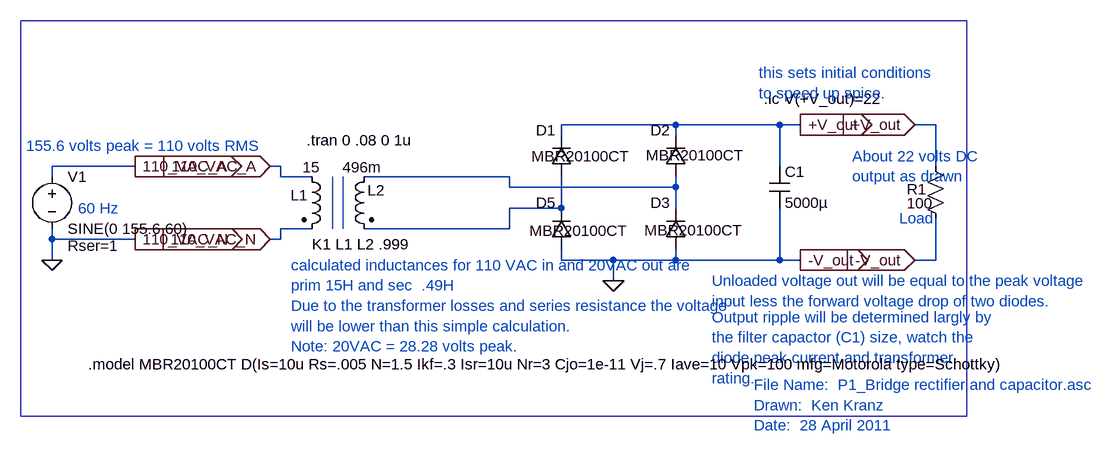
[diagram p0: schematic P1_Bridge_rectifier_and_capacitor.asc]
P1_Bridge_rectifier_and_capacitor.asc, the LTspice schematic file:
Version 4
SHEET 1 1320 680
WIRE 656 0 480 0
WIRE 816 0 656 0
WIRE 848 0 816 0
WIRE 1056 0 1024 0
WIRE 480 16 480 0
WIRE 656 16 656 0
WIRE -176 64 -304 64
WIRE 48 64 32 64
WIRE 816 64 816 0
WIRE 1056 64 1056 0
WIRE -304 80 -304 64
WIRE 48 80 48 64
WIRE 96 80 48 80
WIRE 400 80 176 80
WIRE 400 96 400 80
WIRE 656 96 656 80
WIRE 656 96 400 96
WIRE 480 128 480 80
WIRE 480 128 400 128
WIRE 656 128 656 96
WIRE 96 160 48 160
WIRE 400 160 400 128
WIRE 400 160 176 160
WIRE -304 176 -304 160
WIRE -176 176 -304 176
WIRE 48 176 48 160
WIRE 48 176 32 176
WIRE -304 208 -304 176
WIRE 480 208 480 192
WIRE 560 208 480 208
WIRE 656 208 656 192
WIRE 656 208 560 208
WIRE 816 208 816 128
WIRE 816 208 656 208
WIRE 848 208 816 208
WIRE 1056 208 1056 144
WIRE 1056 208 1024 208
WIRE 560 240 560 208
FLAG 32 64 110_VAC_A
IOPIN 32 64 In
FLAG 32 176 110_VAC_N
IOPIN 32 176 In
FLAG -304 208 0
FLAG -176 64 110_VAC_A
IOPIN -176 64 Out
FLAG -176 176 110_VAC_N
IOPIN -176 176 Out
FLAG 1024 0 +V_out
IOPIN 1024 0 In
FLAG 848 0 +V_out
IOPIN 848 0 Out
FLAG 848 208 -V_out
IOPIN 848 208 Out
FLAG 1024 208 -V_out
IOPIN 1024 208 In
FLAG 560 240 0
SYMBOL ind2 80 64 R0
WINDOW 0 -17 44 Left 0
WINDOW 3 2 1 Left 0
SYMATTR InstName L1
SYMATTR Value 15
SYMATTR Type ind
SYMATTR SpiceLine Rser=1
SYMBOL ind2 192 64 M0
WINDOW 0 -17 37 Left 0
WINDOW 3 -12 1 Left 0
SYMATTR InstName L2
SYMATTR Value 496m
SYMATTR Type ind
SYMATTR SpiceLine Rser=5m
SYMBOL cap 800 64 R0
SYMATTR InstName C1
SYMATTR Value 5000µ
SYMBOL voltage -304 64 R0
WINDOW 123 0 0 Left 0
WINDOW 39 24 122 Left 0
SYMATTR SpiceLine Rser=1
SYMATTR InstName V1
SYMATTR Value SINE(0 155.6 60)
SYMBOL res 1040 48 R0
WINDOW 0 -28 51 Left 0
WINDOW 3 -28 73 Left 0
SYMATTR InstName R1
SYMATTR Value 100
SYMBOL diode 496 192 R180
WINDOW 0 24 72 Left 0
WINDOW 3 -88 29 Left 0
SYMATTR InstName D5
SYMATTR Value MBR20100CT
SYMBOL diode 496 80 R180
WINDOW 0 24 72 Left 0
WINDOW 3 -91 32 Left 0
SYMATTR InstName D1
SYMATTR Value MBR20100CT
SYMBOL diode 672 80 R180
WINDOW 0 24 72 Left 0
WINDOW 3 -91 33 Left 0
SYMATTR InstName D2
SYMATTR Value MBR20100CT
SYMBOL diode 672 192 R180
WINDOW 0 24 72 Left 0
WINDOW 3 -89 30 Left 0
SYMATTR InstName D3
SYMATTR Value MBR20100CT
TEXT 88 24 Left 0 !.tran 0 .08 0 1u
TEXT 96 184 Left 0 !K1 L1 L2 .999
TEXT -344 32 Left 0 ;155.6 volts peak = 110 volts RMS
TEXT -264 128 Left 0 ;60 Hz
TEXT 1000 144 Left 0 ;Load
TEXT 712 240 Left 0 ;Unloaded voltage out will be equal to the peak voltage\ninput less the forward voltage drop of two diodes.
TEXT 792 -40 Left 0 !.ic V(+V_out)=22
TEXT 776 400 Left 0 ;File Name:  P1_Bridge rectifier and capacitor.asc\nDrawn:  Ken Kranz\nDate:  28 April 2011
TEXT 928 48 Left 0 ;About 22 volts DC \noutput as drawn
TEXT 64 216 Left 0 ;calculated inductances for 110 VAC in and 20VAC out are\nprim 15H and sec  .49H\nDue to the transformer losses and series resistance the voltage\nwill be lower than this simple calculation.\nNote: 20VAC = 28.28 volts peak.
TEXT 712 296 Left 0 ;Output ripple will be determined largly by\nthe filter capactor (C1) size, watch the \ndiode peak current and transformer\nrating.
TEXT 784 -80 Left 0 ;this sets initial conditions\nto speed up spice.
TEXT -248 368 Left 0 !.model MBR20100CT D(Is=10u Rs=.005 N=1.5 Ikf=.3 Isr=10u Nr=3 Cjo=1e-11 Vj=.7 Iave=10 Vpk=100 mfg=Motorola type=Schottky)
LINE Normal 128 160 128 80
LINE Normal 144 160 144 80
RECTANGLE Normal -352 -160 1104 448

The netlist it stands for:
* P1_Bridge_rectifier_and_capacitor.asc
L1 110_VAC_A 0 15 Rser=1
L2 N001 N002 496m Rser=5m
C1 +V_out 0 5000µ
V1 110_VAC_A 0 SINE(0 155.6 60) Rser=1
R1 +V_out 0 100
D5 0 N002 MBR20100CT
D1 N002 +V_out MBR20100CT
D2 N001 +V_out MBR20100CT
D3 0 N001 MBR20100CT
.model D D
.lib standard.dio
.tran 0 .08 0 1u
K1 L1 L2 .999
* 155.6 volts peak = 110 volts RMS
* 60 Hz
* Load
* Unloaded voltage out will be equal to the peak voltage
* input less the forward voltage drop of two diodes.
.ic V(+V_out)=22
* File Name:  P1_Bridge rectifier and capacitor.asc
* Drawn:  Ken Kranz
* Date:  28 April 2011
* About 22 volts DC
* output as drawn
* calculated inductances for 110 VAC in and 20VAC out are
* prim 15H and sec  .49H
* Due to the transformer losses and series resistance the voltage
* will be lower than this simple calculation.
* Note: 20VAC = 28.28 volts peak.
* Output ripple will be determined largly by
* the filter capactor (C1) size, watch the
* diode peak current and transformer
* rating.
* this sets initial conditions
* to speed up spice.
.model MBR20100CT D(Is=10u Rs=.005 N=1.5 Ikf=.3 Isr=10u Nr=3 Cjo=1e-11 Vj=.7 Iave=10 Vpk=100 mfg=Motorola type=Schottky)
.backanno
.end